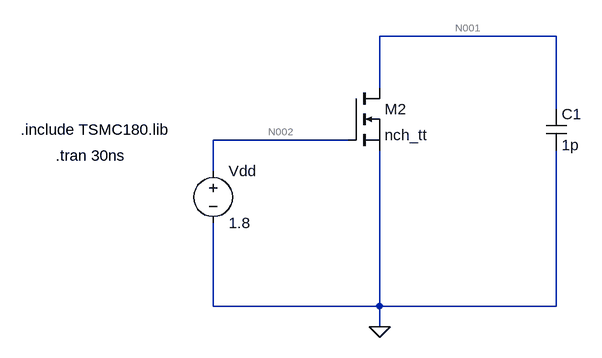
[diagram p0: schematic Q1.asc]
Q1.asc, the LTspice schematic file:
Version 4
SHEET 1 880 680
WIRE 688 32 416 32
WIRE 416 112 416 32
WIRE 688 144 688 32
WIRE 368 192 160 192
WIRE 160 240 160 192
WIRE 160 448 160 320
WIRE 416 448 416 208
WIRE 416 448 160 448
WIRE 688 448 688 208
WIRE 688 448 416 448
WIRE 416 480 416 448
FLAG 416 480 0
SYMBOL voltage 160 224 R0
SYMATTR InstName Vdd
SYMATTR Value 1.8
SYMBOL cap 672 144 R0
SYMATTR InstName C1
SYMATTR Value 1p
SYMATTR SpiceLine IC=1.8
SYMBOL nmos 368 112 R0
SYMATTR InstName M2
SYMATTR Value nch_tt
SYMATTR Value2 l=180n w=240n
TEXT -136 176 Left 2 !.include TSMC180.lib
TEXT -82 216 Left 2 !.tran 30ns

The netlist it stands for:
* Q1.asc
Vdd N002 0 1.8
C1 N001 0 1p IC=1.8
M2 N001 N002 0 0 nch_tt l=180n w=240n
.model NMOS NMOS
.model PMOS PMOS
.lib standard.mos
.include TSMC180.lib
.tran 30ns
.backanno
.end

* Results of the author's LTspice run, read from the files saved beside the schematic
* Operating Point, zero values left out:
*   V(n002) = 1.8 V
*   V(n001) = 1.8 V
*   Id(M2) = 189.3 µA
*   Ib(M2) = -1.81 pA
*   Is(M2) = -189.3 µA
*   I(C1) = -189.3 µA
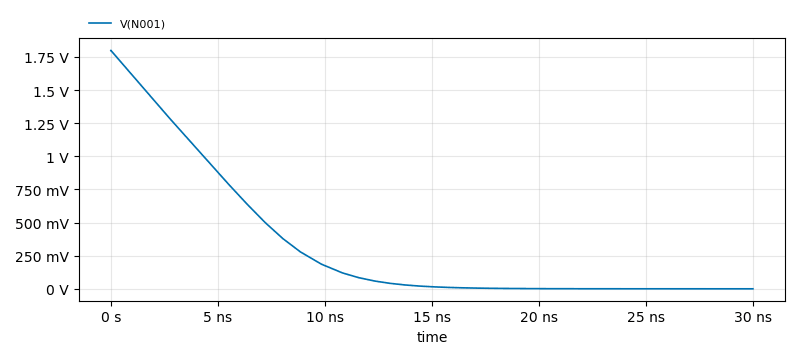
[diagram p1: Transient Analysis of Q1.asc, plotted from the saved traces]
* Transient Analysis, 1 run:
*   V(N001): min 6.719 µV, max 1.8 V, average 315.3 mV, rms 603.9 mV, last 6.719 µV